# EAGLE schematic POVRotor (EAGLE 9.5.1)
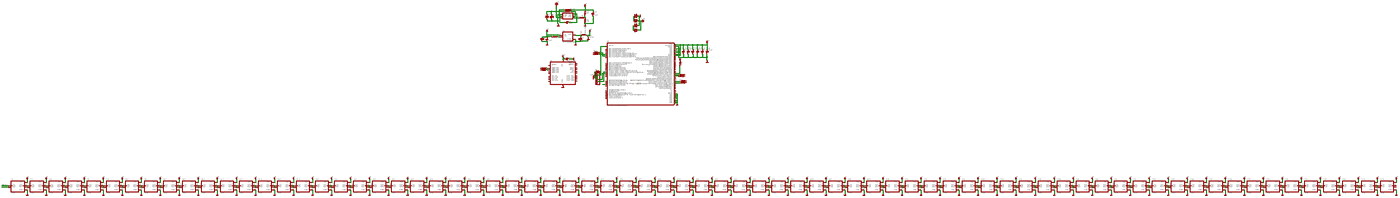
[diagram p0: schematic, sheet 1, overview]
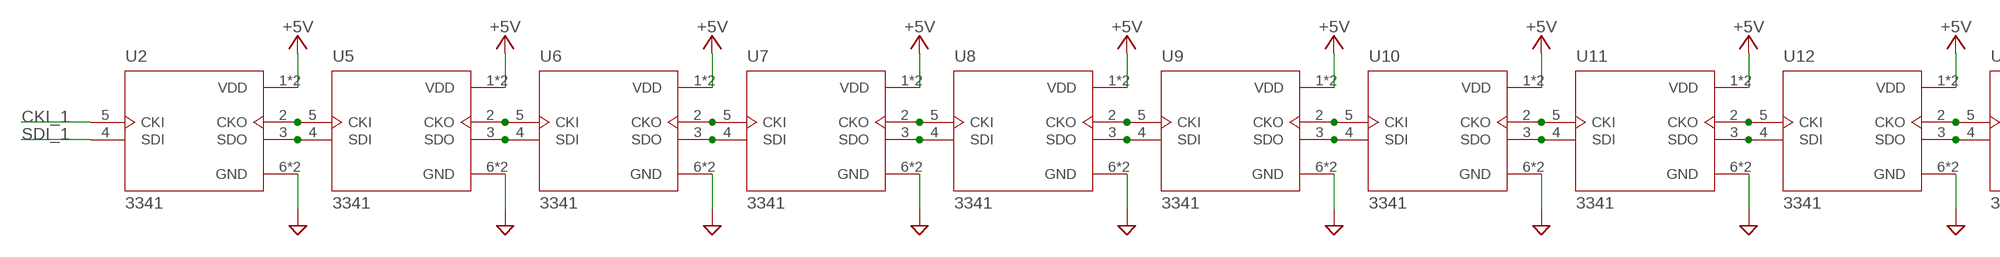
[diagram p1: schematic, sheet 1, part 1 of 8]
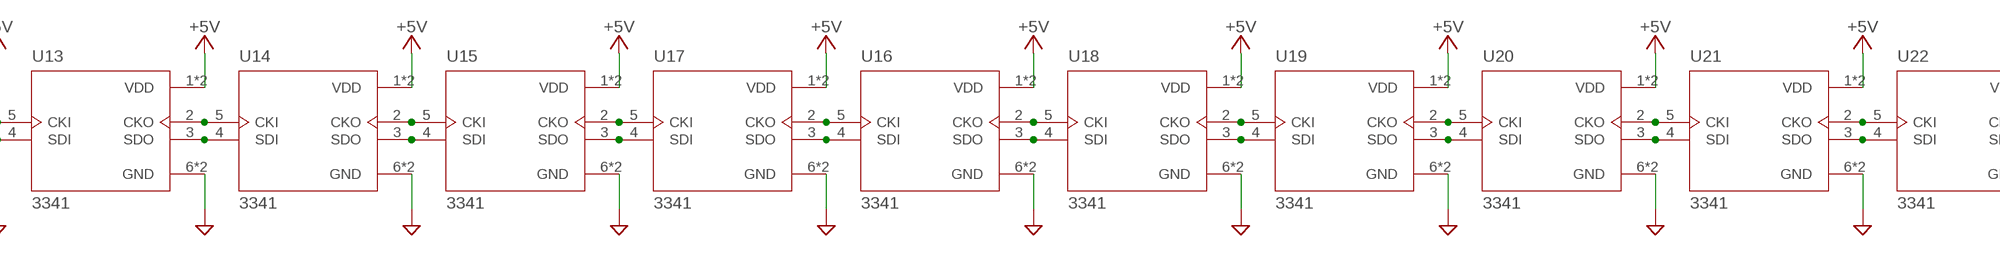
[diagram p2: schematic, sheet 1, part 2 of 8]
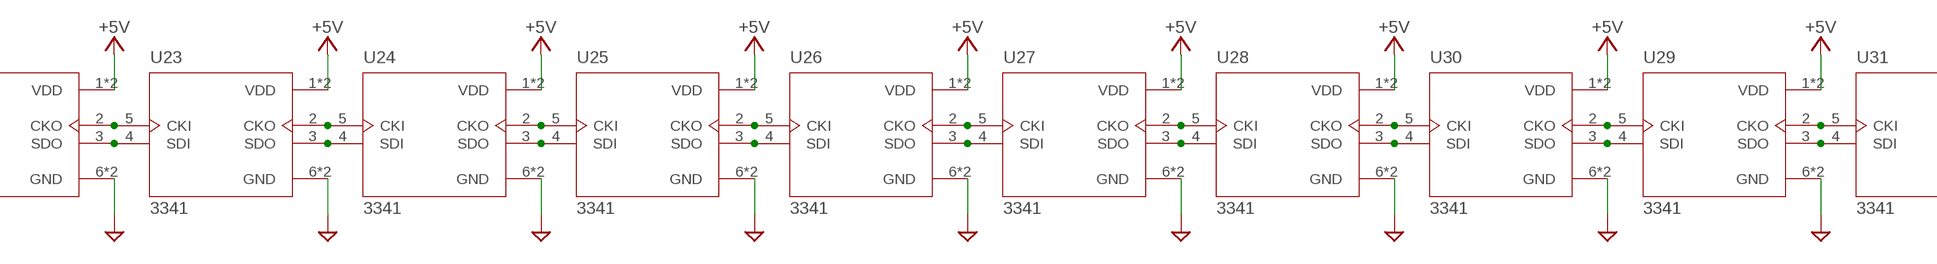
[diagram p3: schematic, sheet 1, part 3 of 8]
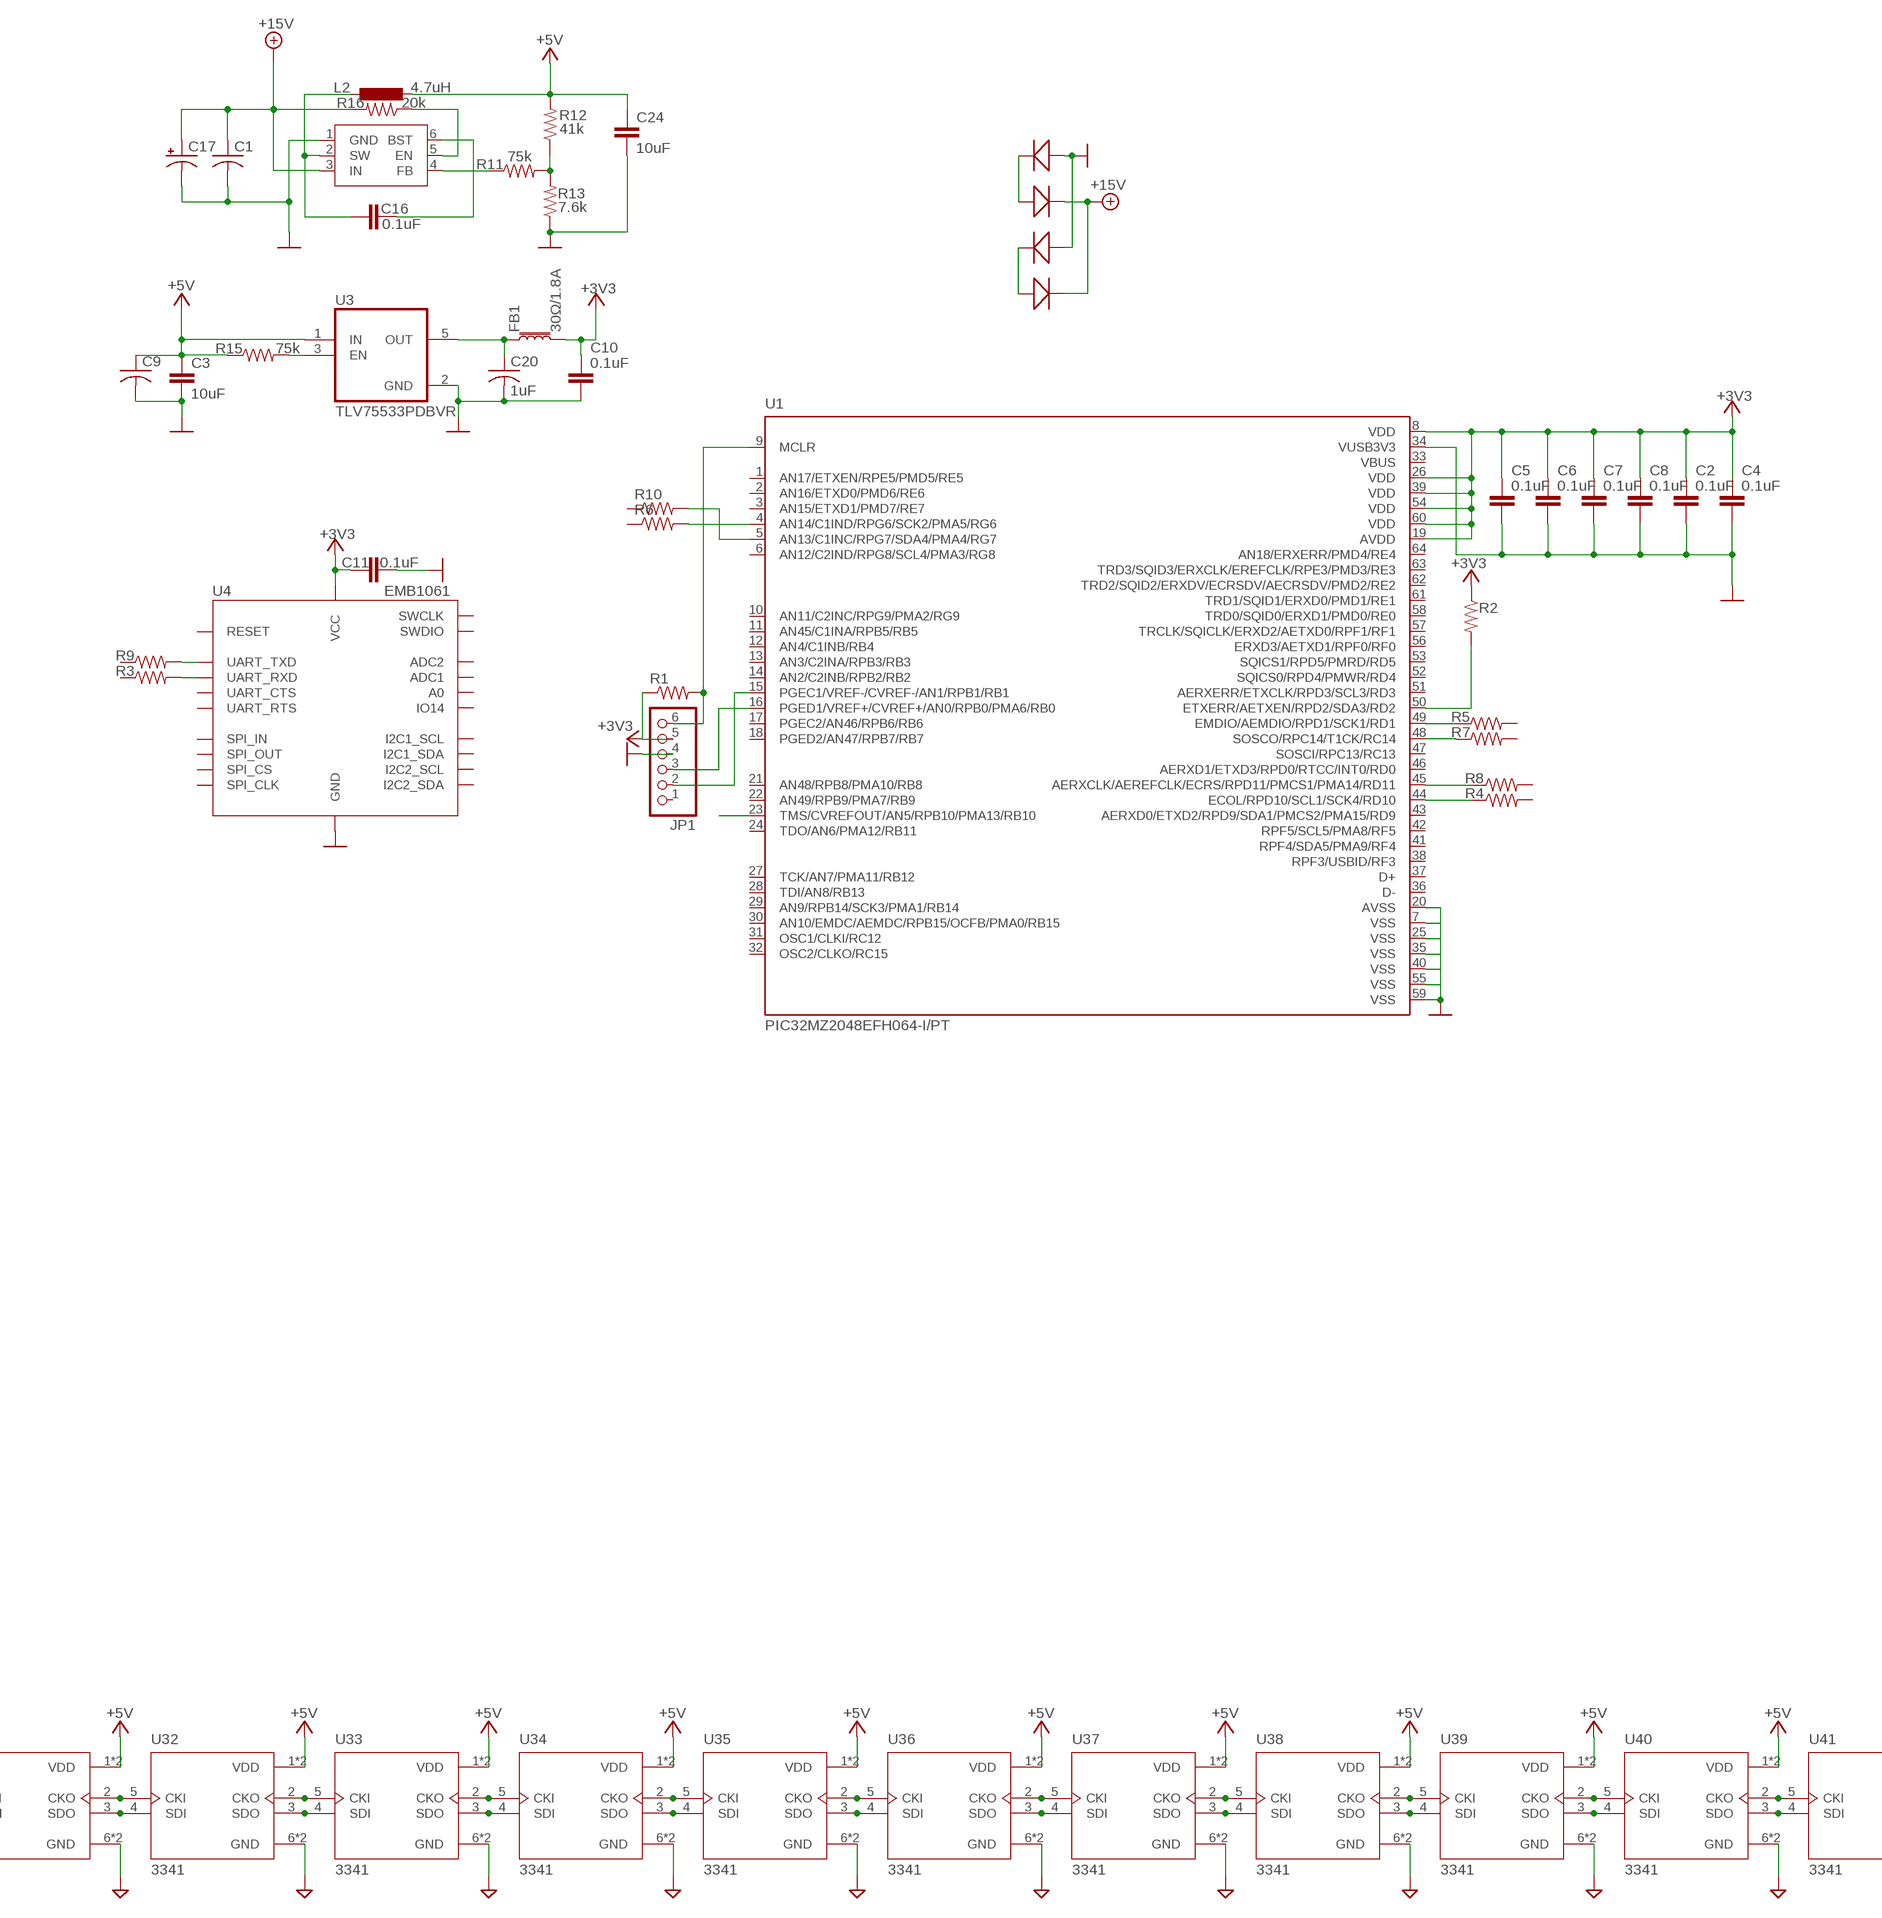
[diagram p4: schematic, sheet 1, part 4 of 8]
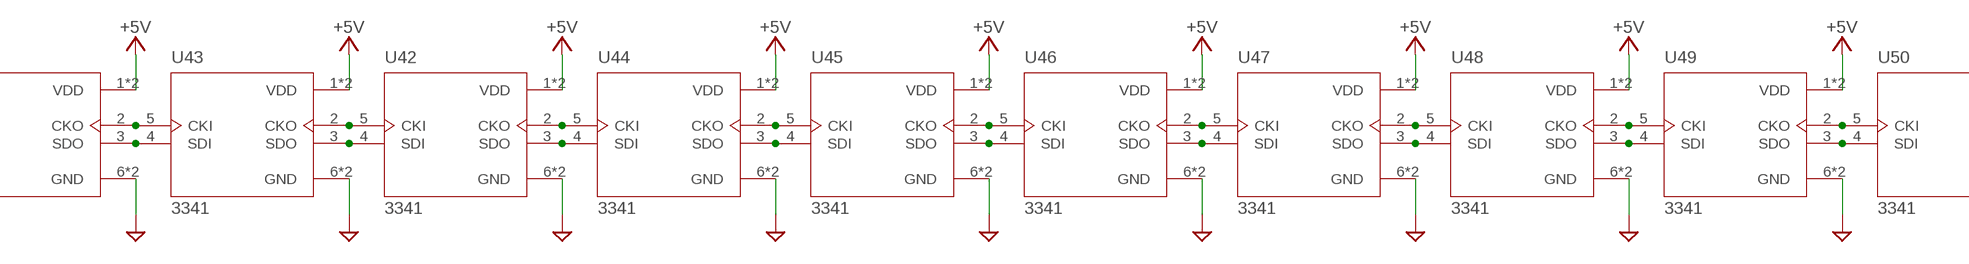
[diagram p5: schematic, sheet 1, part 5 of 8]
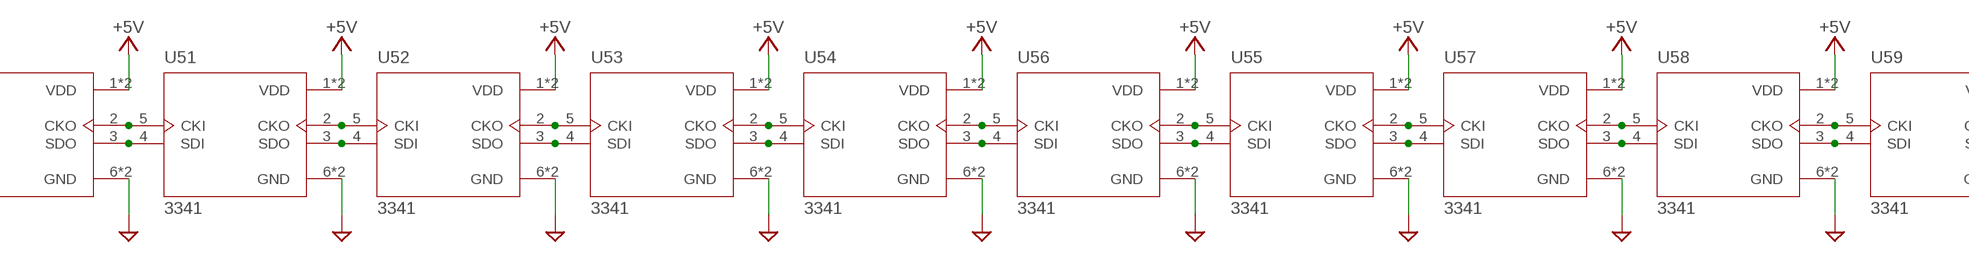
[diagram p6: schematic, sheet 1, part 6 of 8]
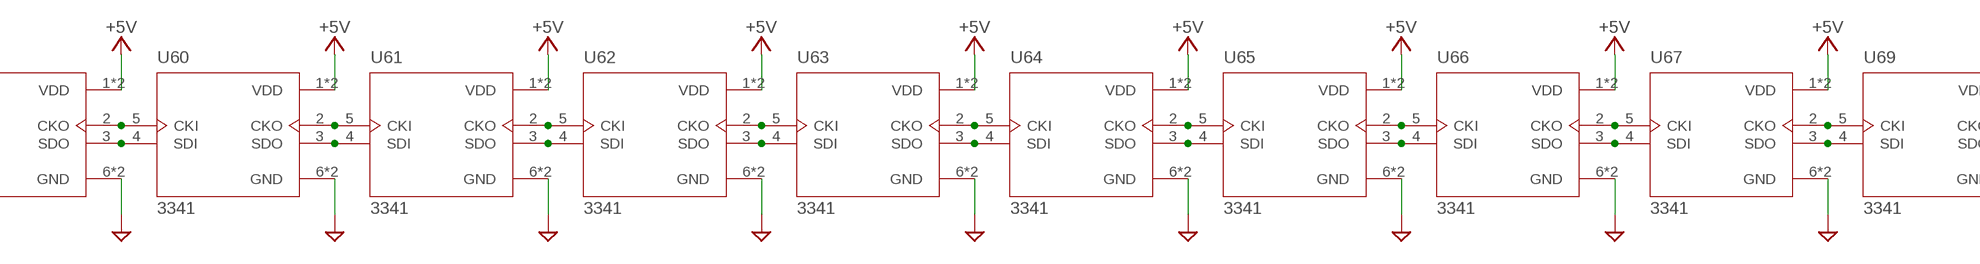
[diagram p7: schematic, sheet 1, part 7 of 8]
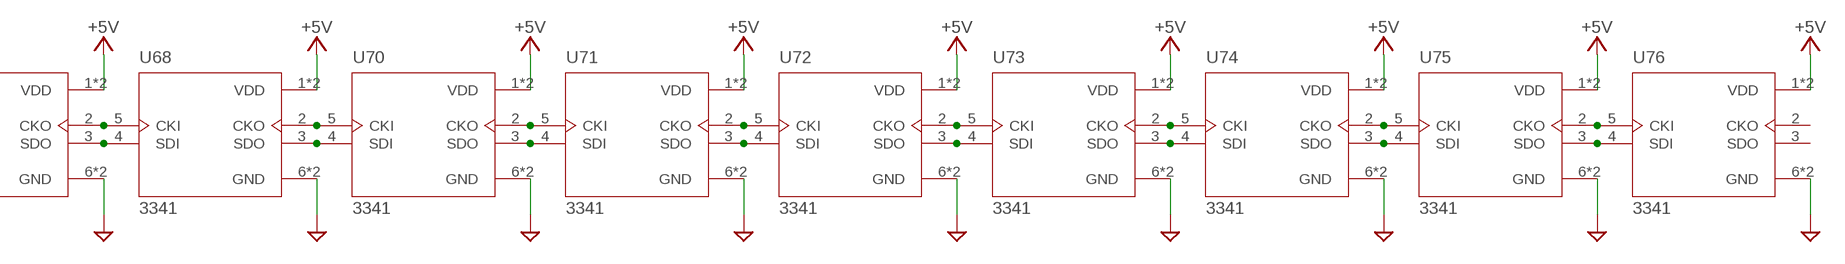
[diagram p8: schematic, sheet 1, part 8 of 8]

## Parts
C1  C-USC0805  [C0805]
C2  0.1uF  C-EUC0603  [C0603]
C3  10uF  C-EUC1206  [C1206]
C4  0.1uF  C-EUC0603  [C0603]
C5  0.1uF  C-EUC0603  [C0603]
C6  0.1uF  C-EUC0603  [C0603]
C7  0.1uF  C-EUC0603  [C0603]
C8  0.1uF  C-EUC0603  [C0603]
C9  C-USC0805  [C0805]
C10  0.1uF  C-EUC0603  [C0603]
C11  0.1uF  C-EUC0603  [C0603]
C16  0.1uF  C-EUC0603  [C0603]
C17  CPOL-USC/6032-28R  [C/6032-28R]
C20  1uF  C-USC0805  [C0805]
C24  10uF  C-EUC1206  [C1206]
D2  SMD-DIODE-SCHOTTKY-40V-3A(DO-214AB)  [DO-214AB]
D3  SMD-DIODE-SCHOTTKY-40V-3A(DO-214AB)  [DO-214AB]
D4  SMD-DIODE-SCHOTTKY-40V-3A(DO-214AB)  [DO-214AB]
D5  SMD-DIODE-SCHOTTKY-40V-3A(DO-214AB)  [DO-214AB]
FB1  30Ω/1.8A  FERRITE_BEAD-0603  [0603]
JP1  PINHD-1X6/90  [1X06/90]
L2  4.7uH  L-EUL2825P  [L2825P]
R1  R-US_R0603  [R0603]
R2  R-US_R0603  [R0603]
R3  R-US_R0603  [R0603]
R4  R-US_R0603  [R0603]
R5  R-US_R0603  [R0603]
R6  R-US_R0603  [R0603]
R7  R-US_R0603  [R0603]
R8  R-US_R0603  [R0603]
R9  R-US_R0603  [R0603]
R10  R-US_R0603  [R0603]
R11  75k  R-US_R0603  [R0603]
R12  41k  R-US_R0603  [R0603]
R13  7.6k  R-US_R0603  [R0603]
R15  75k  R-US_R0603  [R0603]
R16  20k  R-US_R0603  [R0603]
U1  PIC32MZ2048EFH064-I/PT  [QFP50P1200X1200X120-64N]
U2  3341  [LED_3341]
U3  TLV75533PDBVR  [SOT95P280X145-5N]
U4  EMB1061  [EMB1061]
U5  3341  [LED_3341]
U6  3341  [LED_3341]
U7  3341  [LED_3341]
U8  3341  [LED_3341]
U9  3341  [LED_3341]
U10  3341  [LED_3341]
U11  3341  [LED_3341]
U12  3341  [LED_3341]
U13  3341  [LED_3341]
U14  3341  [LED_3341]
U15  3341  [LED_3341]
U16  3341  [LED_3341]
U17  3341  [LED_3341]
U18  3341  [LED_3341]
U19  3341  [LED_3341]
U20  3341  [LED_3341]
U21  3341  [LED_3341]
U22  3341  [LED_3341]
U23  3341  [LED_3341]
U24  3341  [LED_3341]
U25  3341  [LED_3341]
U26  3341  [LED_3341]
U27  3341  [LED_3341]
U28  3341  [LED_3341]
U29  3341  [LED_3341]
U30  3341  [LED_3341]
U31  3341  [LED_3341]
U32  3341  [LED_3341]
U33  3341  [LED_3341]
U34  3341  [LED_3341]
U35  3341  [LED_3341]
U36  3341  [LED_3341]
U37  3341  [LED_3341]
U38  3341  [LED_3341]
U39  3341  [LED_3341]
U40  3341  [LED_3341]
U41  3341  [LED_3341]
U42  3341  [LED_3341]
U43  3341  [LED_3341]
U44  3341  [LED_3341]
U45  3341  [LED_3341]
U46  3341  [LED_3341]
U47  3341  [LED_3341]
U48  3341  [LED_3341]
U49  3341  [LED_3341]
U50  3341  [LED_3341]
U51  3341  [LED_3341]
U52  3341  [LED_3341]
U53  3341  [LED_3341]
U54  3341  [LED_3341]
U55  3341  [LED_3341]
U56  3341  [LED_3341]
U57  3341  [LED_3341]
U58  3341  [LED_3341]
U59  3341  [LED_3341]
U60  3341  [LED_3341]
U61  3341  [LED_3341]
U62  3341  [LED_3341]
U63  3341  [LED_3341]
U64  3341  [LED_3341]
U65  3341  [LED_3341]
U66  3341  [LED_3341]
U67  3341  [LED_3341]
U68  3341  [LED_3341]
U69  3341  [LED_3341]
U70  3341  [LED_3341]
U71  3341  [LED_3341]
U72  3341  [LED_3341]
U73  3341  [LED_3341]
U74  3341  [LED_3341]
U75  3341  [LED_3341]
U76  3341  [LED_3341]
U$74  AP65211A  [SOT95P280X140-6N]

## Nets
+3V3: C2.1 C4.1 C5.1 C6.1 C7.1 C8.1 C10.1 C11.1 FB1.2 JP1.5 R1.1 R2.1 U1.8(VDD) U1.19(AVDD) U1.26(VDD) U1.39(VDD) U1.54(VDD) U1.60(VDD) U4.P$8(VCC)
+5V: C3.1 C9.1 C24.1 L2.1 R12.2 R15.1 U2.1(VDD) U2.8(VDD) U3.1(IN) U5.1(VDD) U5.8(VDD) U6.1(VDD) U6.8(VDD) U7.1(VDD) U7.8(VDD) U8.1(VDD) U8.8(VDD) U9.1(VDD) U9.8(VDD) U10.1(VDD) U10.8(VDD) U11.1(VDD) U11.8(VDD) U12.1(VDD) U12.8(VDD) U13.1(VDD) U13.8(VDD) U14.1(VDD) U14.8(VDD) U15.1(VDD) U15.8(VDD) U16.1(VDD) U16.8(VDD) U17.1(VDD) U17.8(VDD) U18.1(VDD) U18.8(VDD) U19.1(VDD) U19.8(VDD) U20.1(VDD) U20.8(VDD) U21.1(VDD) U21.8(VDD) U22.1(VDD) U22.8(VDD) U23.1(VDD) U23.8(VDD) U24.1(VDD) U24.8(VDD) U25.1(VDD) U25.8(VDD) U26.1(VDD) U26.8(VDD) U27.1(VDD) U27.8(VDD) U28.1(VDD) U28.8(VDD) U29.1(VDD) U29.8(VDD) U30.1(VDD) U30.8(VDD) U31.1(VDD) U31.8(VDD) U32.1(VDD) U32.8(VDD) U33.1(VDD) U33.8(VDD) U34.1(VDD) U34.8(VDD) U35.1(VDD) U35.8(VDD) U36.1(VDD) U36.8(VDD) U37.1(VDD) U37.8(VDD) U38.1(VDD) U38.8(VDD) U39.1(VDD) U39.8(VDD) U40.1(VDD) U40.8(VDD) U41.1(VDD) U41.8(VDD) U42.1(VDD) U42.8(VDD) U43.1(VDD) U43.8(VDD) U44.1(VDD) U44.8(VDD) U45.1(VDD) U45.8(VDD) U46.1(VDD) U46.8(VDD) U47.1(VDD) U47.8(VDD) U48.1(VDD) U48.8(VDD) U49.1(VDD) U49.8(VDD) U50.1(VDD) U50.8(VDD) U51.1(VDD) U51.8(VDD) U52.1(VDD) U52.8(VDD) U53.1(VDD) U53.8(VDD) U54.1(VDD) U54.8(VDD) U55.1(VDD) U55.8(VDD) U56.1(VDD) U56.8(VDD) U57.1(VDD) U57.8(VDD) U58.1(VDD) U58.8(VDD) U59.1(VDD) U59.8(VDD) U60.1(VDD) U60.8(VDD) U61.1(VDD) U61.8(VDD) U62.1(VDD) U62.8(VDD) U63.1(VDD) U63.8(VDD) U64.1(VDD) U64.8(VDD) U65.1(VDD) U65.8(VDD) U66.1(VDD) U66.8(VDD) U67.1(VDD) U67.8(VDD) U68.1(VDD) U68.8(VDD) U69.1(VDD) U69.8(VDD) U70.1(VDD) U70.8(VDD) U71.1(VDD) U71.8(VDD) U72.1(VDD) U72.8(VDD) U73.1(VDD) U73.8(VDD) U74.1(VDD) U74.8(VDD) U75.1(VDD) U75.8(VDD) U76.1(VDD) U76.8(VDD)
+15V: C1.1 C17.+ D2.2(-) D3.2(-) R16.2 U$74.3(IN)
CKI_1: U2.5(CKI)
GND: C1.2 C2.2 C3.2 C4.2 C5.2 C6.2 C7.2 C8.2 C9.2 C10.2 C11.2 C17.- C20.2 C24.2 D4.1(+) D5.1(+) JP1.4 R13.1 U1.7(VSS) U1.20(AVSS) U1.25(VSS) U1.34(VUSB3V3) U1.35(VSS) U1.40(VSS) U1.55(VSS) U1.59(VSS) U2.6(GND) U2.7(GND) U3.2(GND) U4.P$9(GND) U4.P$22(GND) U5.6(GND) U5.7(GND) U6.6(GND) U6.7(GND) U7.6(GND) U7.7(GND) U8.6(GND) U8.7(GND) U9.6(GND) U9.7(GND) U10.6(GND) U10.7(GND) U11.6(GND) U11.7(GND) U12.6(GND) U12.7(GND) U13.6(GND) U13.7(GND) U14.6(GND) U14.7(GND) U15.6(GND) U15.7(GND) U16.6(GND) U16.7(GND) U17.6(GND) U17.7(GND) U18.6(GND) U18.7(GND) U19.6(GND) U19.7(GND) U20.6(GND) U20.7(GND) U21.6(GND) U21.7(GND) U22.6(GND) U22.7(GND) U23.6(GND) U23.7(GND) U24.6(GND) U24.7(GND) U25.6(GND) U25.7(GND) U26.6(GND) U26.7(GND) U27.6(GND) U27.7(GND) U28.6(GND) U28.7(GND) U29.6(GND) U29.7(GND) U30.6(GND) U30.7(GND) U31.6(GND) U31.7(GND) U32.6(GND) U32.7(GND) U33.6(GND) U33.7(GND) U34.6(GND) U34.7(GND) U35.6(GND) U35.7(GND) U36.6(GND) U36.7(GND) U37.6(GND) U37.7(GND) U38.6(GND) U38.7(GND) U39.6(GND) U39.7(GND) U40.6(GND) U40.7(GND) U41.6(GND) U41.7(GND) U42.6(GND) U42.7(GND) U43.6(GND) U43.7(GND) U44.6(GND) U44.7(GND) U45.6(GND) U45.7(GND) U46.6(GND) U46.7(GND) U47.6(GND) U47.7(GND) U48.6(GND) U48.7(GND) U49.6(GND) U49.7(GND) U50.6(GND) U50.7(GND) U51.6(GND) U51.7(GND) U52.6(GND) U52.7(GND) U53.6(GND) U53.7(GND) U54.6(GND) U54.7(GND) U55.6(GND) U55.7(GND) U56.6(GND) U56.7(GND) U57.6(GND) U57.7(GND) U58.6(GND) U58.7(GND) U59.6(GND) U59.7(GND) U60.6(GND) U60.7(GND) U61.6(GND) U61.7(GND) U62.6(GND) U62.7(GND) U63.6(GND) U63.7(GND) U64.6(GND) U64.7(GND) U65.6(GND) U65.7(GND) U66.6(GND) U66.7(GND) U67.6(GND) U67.7(GND) U68.6(GND) U68.7(GND) U69.6(GND) U69.7(GND) U70.6(GND) U70.7(GND) U71.6(GND) U71.7(GND) U72.6(GND) U72.7(GND) U73.6(GND) U73.7(GND) U74.6(GND) U74.7(GND) U75.6(GND) U75.7(GND) U76.6(GND) U76.7(GND) U$74.1(GND)
N$1: D2.1(+) D5.2(-)
N$2: D3.1(+) D4.2(-)
N$3: R15.2 U3.3(EN)
N$4: R7.1 U1.48(SOSCO/RPC14/T1CK/RC14)
N$5: R2.2 U1.50(ETXERR/AETXEN/RPD2/SDA3/RD2)
N$6: R16.1 U$74.5(EN)
N$7: U5.2(CKO) U6.5(CKI)
N$8: U5.3(SDO) U6.4(SDI)
N$9: U2.2(CKO) U5.5(CKI)
N$10: U2.3(SDO) U5.4(SDI)
N$11: U6.2(CKO) U7.5(CKI)
N$12: JP1.3 U1.16(PGED1/VREF+/CVREF+/AN0/RPB0/PMA6/RB0)
N$13: JP1.2 U1.15(PGEC1/VREF-/CVREF-/AN1/RPB1/RB1)
N$14: JP1.6 R1.2 U1.9(MCLR)
N$15: U26.2(CKO) U27.5(CKI)
N$16: U6.3(SDO) U7.4(SDI)
N$17: U7.2(CKO) U8.5(CKI)
N$18: U7.3(SDO) U8.4(SDI)
N$19: R5.1 U1.49(EMDIO/AEMDIO/RPD1/SCK1/RD1)
N$20: U8.2(CKO) U9.5(CKI)
N$21: R4.1 U1.44(ECOL/RPD10/SCL1/SCK4/RD10)
N$24: U8.3(SDO) U9.4(SDI)
N$25: U9.2(CKO) U10.5(CKI)
N$27: U9.3(SDO) U10.4(SDI)
N$28: U10.2(CKO) U11.5(CKI)
N$29: U10.3(SDO) U11.4(SDI)
N$30: U11.2(CKO) U12.5(CKI)
N$31: U11.3(SDO) U12.4(SDI)
N$32: U12.2(CKO) U13.5(CKI)
N$33: U12.3(SDO) U13.4(SDI)
N$34: U13.2(CKO) U14.5(CKI)
N$35: U13.3(SDO) U14.4(SDI)
N$36: U14.2(CKO) U15.5(CKI)
N$37: U14.3(SDO) U15.4(SDI)
N$38: U15.2(CKO) U17.5(CKI)
N$39: U15.3(SDO) U17.4(SDI)
N$40: U16.5(CKI) U17.2(CKO)
N$41: U16.4(SDI) U17.3(SDO)
N$42: U18.2(CKO) U19.5(CKI)
N$43: U18.3(SDO) U19.4(SDI)
N$44: U16.2(CKO) U18.5(CKI)
N$45: R6.2 U1.4(AN14/C1IND/RPG6/SCK2/PMA5/RG6)
N$46: U16.3(SDO) U18.4(SDI)
N$47: U19.2(CKO) U20.5(CKI)
N$48: U19.3(SDO) U20.4(SDI)
N$49: U20.2(CKO) U21.5(CKI)
N$50: R8.1 U1.45(AERXCLK/AEREFCLK/ECRS/RPD11/PMCS1/PMA14/RD11)
N$51: U20.3(SDO) U21.4(SDI)
N$52: U21.2(CKO) U22.5(CKI)
N$53: U21.3(SDO) U22.4(SDI)
N$54: U22.2(CKO) U23.5(CKI)
N$55: U22.3(SDO) U23.4(SDI)
N$56: U23.2(CKO) U24.5(CKI)
N$57: U23.3(SDO) U24.4(SDI)
N$58: U24.2(CKO) U25.5(CKI)
N$59: U24.3(SDO) U25.4(SDI)
N$60: U25.2(CKO) U26.5(CKI)
N$61: U25.3(SDO) U26.4(SDI)
N$62: C20.1 FB1.1 U3.5(OUT)
N$63: U26.3(SDO) U27.4(SDI)
N$64: U27.2(CKO) U28.5(CKI)
N$65: U27.3(SDO) U28.4(SDI)
N$66: U28.2(CKO) U30.5(CKI)
N$67: U28.3(SDO) U30.4(SDI)
N$68: U29.5(CKI) U30.2(CKO)
N$69: U29.4(SDI) U30.3(SDO)
N$70: U31.2(CKO) U32.5(CKI)
N$71: U31.3(SDO) U32.4(SDI)
N$72: U29.2(CKO) U31.5(CKI)
N$73: U29.3(SDO) U31.4(SDI)
N$74: U32.2(CKO) U33.5(CKI)
N$75: U32.3(SDO) U33.4(SDI)
N$76: U33.2(CKO) U34.5(CKI)
N$77: U33.3(SDO) U34.4(SDI)
N$78: U34.2(CKO) U35.5(CKI)
N$79: U34.3(SDO) U35.4(SDI)
N$80: U35.2(CKO) U36.5(CKI)
N$81: U35.3(SDO) U36.4(SDI)
N$82: U36.2(CKO) U37.5(CKI)
N$83: U36.3(SDO) U37.4(SDI)
N$84: U37.2(CKO) U38.5(CKI)
N$85: U37.3(SDO) U38.4(SDI)
N$86: U38.2(CKO) U39.5(CKI)
N$87: U38.3(SDO) U39.4(SDI)
N$88: U39.2(CKO) U40.5(CKI)
N$89: U39.3(SDO) U40.4(SDI)
N$90: U40.2(CKO) U41.5(CKI)
N$91: U40.3(SDO) U41.4(SDI)
N$92: U1.23(TMS/CVREFOUT/AN5/RPB10/PMA13/RB10)
N$93: U41.2(CKO) U43.5(CKI)
N$94: U41.3(SDO) U43.4(SDI)
N$95: U42.5(CKI) U43.2(CKO)
N$96: U42.4(SDI) U43.3(SDO)
N$97: U44.2(CKO) U45.5(CKI)
N$98: U44.3(SDO) U45.4(SDI)
N$99: U42.2(CKO) U44.5(CKI)
N$100: U42.3(SDO) U44.4(SDI)
N$101: U45.2(CKO) U46.5(CKI)
N$102: U45.3(SDO) U46.4(SDI)
N$103: U46.2(CKO) U47.5(CKI)
N$104: U46.3(SDO) U47.4(SDI)
N$105: U47.2(CKO) U48.5(CKI)
N$106: U47.3(SDO) U48.4(SDI)
N$107: U48.2(CKO) U49.5(CKI)
N$108: U48.3(SDO) U49.4(SDI)
N$109: U49.2(CKO) U50.5(CKI)
N$110: U49.3(SDO) U50.4(SDI)
N$111: U50.2(CKO) U51.5(CKI)
N$112: R10.2 U1.5(AN13/C1INC/RPG7/SDA4/PMA4/RG7)
N$113: U50.3(SDO) U51.4(SDI)
N$114: U51.2(CKO) U52.5(CKI)
N$115: U51.3(SDO) U52.4(SDI)
N$116: U52.2(CKO) U53.5(CKI)
N$117: U52.3(SDO) U53.4(SDI)
N$118: U53.2(CKO) U54.5(CKI)
N$119: U53.3(SDO) U54.4(SDI)
N$120: U54.2(CKO) U56.5(CKI)
N$121: U54.3(SDO) U56.4(SDI)
N$122: U55.5(CKI) U56.2(CKO)
N$123: U55.4(SDI) U56.3(SDO)
N$124: U57.2(CKO) U58.5(CKI)
N$125: U57.3(SDO) U58.4(SDI)
N$126: U55.2(CKO) U57.5(CKI)
N$127: U55.3(SDO) U57.4(SDI)
N$128: U58.2(CKO) U59.5(CKI)
N$129: C16.1 L2.2 U$74.2(SW)
N$130: C16.2 U$74.6(BST)
N$131: U58.3(SDO) U59.4(SDI)
N$132: U59.2(CKO) U60.5(CKI)
N$133: U59.3(SDO) U60.4(SDI)
N$134: U60.2(CKO) U61.5(CKI)
N$135: U60.3(SDO) U61.4(SDI)
N$136: U61.2(CKO) U62.5(CKI)
N$137: U61.3(SDO) U62.4(SDI)
N$138: U62.2(CKO) U63.5(CKI)
N$139: U62.3(SDO) U63.4(SDI)
N$140: U63.2(CKO) U64.5(CKI)
N$141: U63.3(SDO) U64.4(SDI)
N$142: U64.2(CKO) U65.5(CKI)
N$143: U64.3(SDO) U65.4(SDI)
N$144: U65.2(CKO) U66.5(CKI)
N$145: U65.3(SDO) U66.4(SDI)
N$146: U66.2(CKO) U67.5(CKI)
N$147: U66.3(SDO) U67.4(SDI)
N$148: U67.2(CKO) U69.5(CKI)
N$149: U67.3(SDO) U69.4(SDI)
N$150: U68.5(CKI) U69.2(CKO)
N$151: U68.4(SDI) U69.3(SDO)
N$152: U70.2(CKO) U71.5(CKI)
N$153: U70.3(SDO) U71.4(SDI)
N$154: U68.2(CKO) U70.5(CKI)
N$155: U68.3(SDO) U70.4(SDI)
N$156: U71.2(CKO) U72.5(CKI)
N$157: U71.3(SDO) U72.4(SDI)
N$158: U72.2(CKO) U73.5(CKI)
N$159: U72.3(SDO) U73.4(SDI)
N$160: U73.2(CKO) U74.5(CKI)
N$161: U73.3(SDO) U74.4(SDI)
N$162: U74.2(CKO) U75.5(CKI)
N$163: U74.3(SDO) U75.4(SDI)
N$164: U75.2(CKO) U76.5(CKI)
N$165: U75.3(SDO) U76.4(SDI)
N$166: R9.2 U4.P$10(UART_TXD)
N$167: R11.1 U$74.4(FB)
N$168: R11.2 R12.1 R13.2
N$169: R3.2 U4.P$11(UART_RXD)
SDI_1: U2.4(SDI)
Unconnected: JP1.1 R3.1 R4.2 R5.2 R6.1 R7.2 R8.2 R9.1 R10.1 U1.1(AN17/ETXEN/RPE5/PMD5/RE5) U1.2(AN16/ETXD0/PMD6/RE6) U1.3(AN15/ETXD1/PMD7/RE7) U1.6(AN12/C2IND/RPG8/SCL4/PMA3/RG8) U1.10(AN11/C2INC/RPG9/PMA2/RG9) U1.11(AN45/C1INA/RPB5/RB5) U1.12(AN4/C1INB/RB4) U1.13(AN3/C2INA/RPB3/RB3) U1.14(AN2/C2INB/RPB2/RB2) U1.17(PGEC2/AN46/RPB6/RB6) U1.18(PGED2/AN47/RPB7/RB7) U1.21(AN48/RPB8/PMA10/RB8) U1.22(AN49/RPB9/PMA7/RB9) U1.24(TDO/AN6/PMA12/RB11) U1.27(TCK/AN7/PMA11/RB12) U1.28(TDI/AN8/RB13) U1.29(AN9/RPB14/SCK3/PMA1/RB14) U1.30(AN10/EMDC/AEMDC/RPB15/OCFB/PMA0/RB15) U1.31(OSC1/CLKI/RC12) U1.32(OSC2/CLKO/RC15) U1.36(D-) U1.37(D+) U1.38(RPF3/USBID/RF3) U1.41(RPF4/SDA5/PMA9/RF4) U1.42(RPF5/SCL5/PMA8/RF5) U1.43(AERXD0/ETXD2/RPD9/SDA1/PMCS2/PMA15/RD9) U1.46(AERXD1/ETXD3/RPD0/RTCC/INT0/RD0) U1.47(SOSCI/RPC13/RC13) U1.51(AERXERR/ETXCLK/RPD3/SCL3/RD3) U1.52(SQICS0/RPD4/PMWR/RD4) U1.53(SQICS1/RPD5/PMRD/RD5) U1.56(ERXD3/AETXD1/RPF0/RF0) U1.57(TRCLK/SQICLK/ERXD2/AETXD0/RPF1/RF1) U1.58(TRD0/SQID0/ERXD1/PMD0/RE0) U1.61(TRD1/SQID1/ERXD0/PMD1/RE1) U1.62(TRD2/SQID2/ERXDV/ECRSDV/AECRSDV/PMD2/RE2) U1.63(TRD3/SQID3/ERXCLK/EREFCLK/RPE3/PMD3/RE3) U1.64(AN18/ERXERR/PMD4/RE4) U4.P$1(I2C1_SDA) U4.P$2(I2C1_SCL) U4.P$3(RESET) U4.P$4(SWDIO) U4.P$5(SWCLK) U4.P$6(UART_CTS) U4.P$7(UART_RTS) U4.P$12(SPI_IN) U4.P$13(SPI_OUT) U4.P$14(SPI_CS) U4.P$15(SPI_CLK) U4.P$16(I2C2_SDA) U4.P$17(I2C2_SCL) U4.P$18(IO14) U4.P$19(A0) U4.P$20(ADC1) U4.P$21(ADC2) U76.2(CKO) U76.3(SDO)

## Power pins joined to a net without a drawn wire
VBUS: U1.33(VBUS)

## Library data of the parts
C1 C9 = resistor:C-US: CAPACITOR, American symbol
C2-C8 C10 C11 C16 C24 = rcl:C-EU: CAPACITOR, European symbol; SPICEPREFIX: C
C17 = rcl:CPOL-US: POLARIZED CAPACITOR, American symbol; SPICEPREFIX: C
C20 = rcl:C-US: CAPACITOR, American symbol; SPICEPREFIX: C
D2-D5 = SMD-DIODE-SCHOTTKY-40V-3A_DO-214AB_:SMD-DIODE-SCHOTTKY-40V-3A(DO-214AB): 304020018; AVAILABILITY: Good; DESCRIPTION: Rectifier%2C Schottky%3B DO-214AB%3B 3.0A IF%3B 0.75V%3B 40V%3B 100A IFRM%3B 10000V/us%3B 1000pF; MF: Vishay; MP: SS34-E3/57T; PACKAGE: DO-214 Vishay; PRICE: 0.24 USD
FB1 = SparkFun-Coils:FERRITE_BEAD: Ferrite Bead (blocks, cores, rings, chokes, etc.) Inductor with layers of ferrite used to suppress high frequencies. Often used to isolate high frequency noise. SparkFun Products: IOIO-OTG - V2.2 <https://www.sparkfun.com/products/13613> SparkFun SAMD21 Mini Breakout <https://www.sparkfun.com/products/13664> SparkFun 6 Degrees of Freedom Breakout - LSM6DS3 <https://www.sparkfun.com/products/13339> SparkFun SAMD21 Dev Breakout <https://www.sparkfun.com/products/13672>; PROD_ID: NDUC-07859
JP1 = pinhead:PINHD-1X6: PIN HEADER
L2 = rcl:L-EU: INDUCTOR, European symbol; SPICEPREFIX: L
R1-R10 = resistor:R-US_: RESISTOR, American symbol
R11-R13 R15 R16 = rcl:R-US_: RESISTOR, American symbol; SPICEPREFIX: R
U1 = PIC32MZ2048EFH064-I_PT:PIC32MZ2048EFH064-I/PT: PIC32MZ Series 2 MB Flash 512 kB RAM 200 MHz 32-Bit Microcontroller - TQFP-64; AVAILABILITY: Good; DESCRIPTION: PIC32MZ Series 2 MB Flash 512 kB RAM 200 MHz 32-Bit Microcontroller - TQFP-64; MF: Microchip; MP: PIC32MZ2048EFH064-I/PT; PACKAGE: TQFP-64 Microchip; PRICE: 11.29 USD
U2 U5-U76 = APA102:3341: DotStar Micro LEDs (APA102–2020) - Smart SMD RGB LED - 10 pack; AVAILABILITY: Unavailable; DESCRIPTION: APA102-2020-256-8 is a type ic for the three-color RGB Diming control strip and string.; MF: Adafruit Industries; MP: APA-102-2020-256-8; PACKAGE: SOIC-20 Adafruit Industries; PRICE: None
U3 = TLV75533PDBVR:TLV75533PDBVR: 500mA Low-IQ Small-Size Low-Dropout (LDO) Regulator 5-SOT-23 -40 to 125; AVAILABILITY: Unavailable; DESCRIPTION: 500mA Low-IQ Small-Size Low-Dropout _LDO_ Regulator 5-SOT-23 -40 to 125; MF: Texas Instruments; MP: TLV75533PDBVR; PACKAGE: SOT-23 Texas Instruments; PRICE: None
U4 = EMB1061:EMB1061: u-blox SAM GNSS antenna module; AVAILABILITY: Unavailable; DESCRIPTION: u-Blox M8 Gnss Antenna Module; MF: U-Blox America; MP: SAM-M8Q; PACKAGE: SMD-20 U-Blox America; PRICE: None
U$74 = SOT95P280X140-6N:AP65211A